# Altium project Mirror TurnSignal.PrjPcb
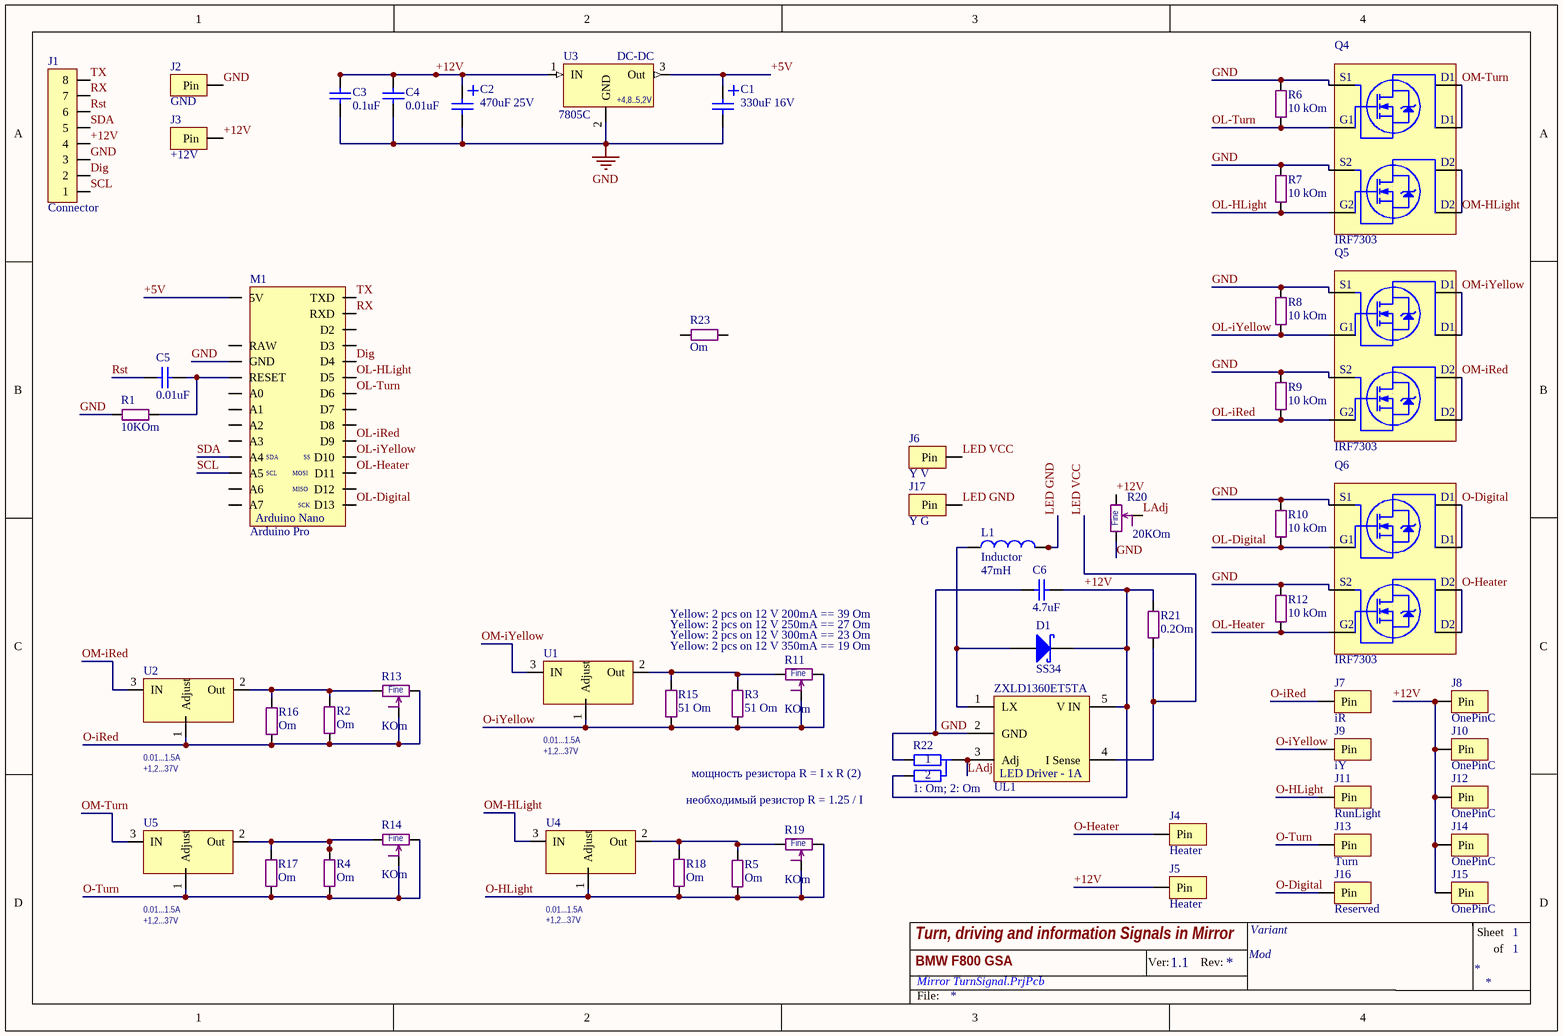
[diagram p0: Mirror TurnSignal.SchDoc]
1 sheet, 58 parts. Net scope: global (net labels, ports and power ports of the same name join across sheets).
Board files: Mirror TurnSignal (Right ver).PcbDoc, Mirror TurnSignal.PcbDoc

## Sheet Mirror TurnSignal.SchDoc: Turn, driving and information Signals in Mirror
size A4; SheetNumber: 1; SheetTotal: 1; Version: 1.1; Variant: Variant; Modification: Mod; Project: BMW F800 GSA

### Parts
C1  330uF 16V  [Cap E p3.5mm D8xH12 R - PR]
C2  470uF 25V  [Cap E p3.5mm D8xH12]
C3  0.1uF  [SMD 0805 (2012)]
C4  0.01uF  [SMD 0805 (2012)]
C5  0.01uF  [SMD 0805 (2012)]
C6  4.7uF  [SMD 1206 (3216)]
D1  SS34  [DO-214AC (SMA)]
J1  Connector  [Molex Micro-Fit 3.0 - 8 pin D R]
J2  GND  [OnePin 1.2x3]
J3  +12V  [OnePin 1.2x3]
J4  Heater  [OnePin 3x10mm Hole 0.7x8]
J5  Heater  [OnePin 3x10mm Hole 0.7x8]
J6  Y V  [OnePin 1.2x3]
J7  iR  [OnePin 1.2x3]
J8  OnePinC  [OnePin 1.2x3]
J9  iY  [OnePin 1.2x3]
J10  OnePinC  [OnePin 1.2x3]
J11  RunLight  [OnePin 1.2x3]
J12  OnePinC  [OnePin 1.2x3]
J13  Turn  [OnePin 1.2x3]
J14  OnePinC  [OnePin 1.2x3]
J15  OnePinC  [OnePin 1.2x3]
J16  Reserved  [OnePin 1.2x3]
J17  Y G  [OnePin 1.2x3]
L1  Inductor  value 47mH  [47 mkH]
M1  Arduino Pro  [Arduino Pro Mini Low (no A0-3,6-7,D3)]
Q4  IRF7303  [SO8]
Q5  IRF7303  [SO8]
Q6  IRF7303  [SO8]
R1  10KOm  [SMD 0805 (2012)]
R2  Om  [Res 2W p15.24]
R3  51 Om  [Res 2W p15.24]
R4  Om  [Res 2W p15.24]
R5  Om  [Res 2W p15.24]
R6  10 kOm  [SMD 0805 (2012)]
R7  10 kOm  [SMD 0805 (2012)]
R8  10 kOm  [SMD 0805 (2012)]
R9  10 kOm  [SMD 0805 (2012)]
R10  10 kOm  [SMD 0805 (2012)]
R11  КOm  [Res Adj 3296 Univ]
R12  10 kOm  [SMD 0805 (2012)]
R13  КOm  [Res Adj 3296 Univ]
R14  КOm  [Res Adj 3296 Univ]
R15  51 Om  [Res 2W p15.24]
R16  Om  [Res 2W p15.24]
R17  Om  [Res 2W p15.24]
R18  Om  [Res 2W p15.24]
R19  КOm  [Res Adj 3296 Univ]
R20  20КOm  [Res Adj 2.54 X 3]
R21  0.2Om  [SMD 2512 (6432)]
R22  1: Om; 2: Om  [SMD 0805 (2012) Double]
R23  Om  [Res 5W L22mm, p22.86]
U1  I output (A) Adjustable: 0.01...1.5A  V Out: +1,2...37V  [TO220 L - 20DG]
U2  I output (A) Adjustable: 0.01...1.5A  V Out: +1,2...37V  [TO220 L - 20DG]
U3  7805C  V Out: +4,8..5,2V  [D-PAK]
U4  I output (A) Adjustable: 0.01...1.5A  V Out: +1,2...37V  [TO220 L - 20DG]
U5  I output (A) Adjustable: 0.01...1.5A  V Out: +1,2...37V  [TO220 L - 20DG]
UL1  ZXLD1360ET5TA  [SOT-23-5]

### Nets
GND: C1.2 C2.2 C3.2 C4.2 C6.1 J1.3 J2.1(Pin) M1.GND Q4.1(S) Q4.3(S) Q5.1(S) Q5.3(S) Q6.1(S) Q6.3(S) R1.1 R6.2 R7.2 R8.2 R9.2 R10.2 R12.2 R20.1 R22.1 U3.2(GND) UL1.2(GND)
+5V: C1.1 M1.5V U3.3(Out)
+12V: C2.1 C3.1 C4.1 C6.2 D1.K J1.4 J3.1(Pin) J5.1(Pin) J8.1(Pin) J10.1(Pin) J12.1(Pin) J14.1(Pin) J15.1(Pin) R20.3 R21.2 R22.2 U3.1(IN) UL1.5(V_IN)
Dig: J1.2 M1.D4
LAdj: R20.2 R22.3 UL1.3(Adj)
LED GND: J17.1(Pin) L1.2
LED VCC: J6.1(Pin) R21.1 UL1.4(I_Sense)
O-Digital: J16.1(Pin) Q6.7(D) Q6.8(D)
O-Heater: J4.1(Pin) Q6.5(D) Q6.6(D)
O-HLight: J11.1(Pin) R5.1 R18.1 R19.2 R19.3 U4.1(Adjust)
O-iRed: J7.1(Pin) R2.1 R13.2 R13.3 R16.1 U2.1(Adjust)
O-iYellow: J9.1(Pin) R3.1 R11.2 R11.3 R15.1 U1.1(Adjust)
O-Turn: J13.1(Pin) R4.1 R14.2 R14.3 R17.1 U5.1(Adjust)
OL-Digital: M1.D13 Q6.2(G) R10.1
OL-Heater: M1.D11 Q6.4(G) R12.1
OL-HLight: M1.D5 Q4.4(G) R7.1
OL-iRed: M1.D9 Q5.4(G) R9.1
OL-iYellow: M1.D10 Q5.2(G) R8.1
OL-Turn: M1.D6 Q4.2(G) R6.1
OM-HLight: Q4.5(D) Q4.6(D) U4.3(IN)
OM-iRed: Q5.5(D) Q5.6(D) U2.3(IN)
OM-iYellow: Q5.7(D) Q5.8(D) U1.3(IN)
OM-Turn: Q4.7(D) Q4.8(D) U5.3(IN)
Rst: C5.1 J1.6
RX: J1.7 M1.RXD
SCL: J1.1 M1.A5
SDA: J1.5 M1.A4
TX: J1.8 M1.TXD
NetC5_2: C5.2 M1.RESET R1.2
NetD1_A: D1.A L1.1 UL1.1(LX)
NetR2_2: R2.2 R13.1 R16.2 U2.2(Out)
NetR3_2: R3.2 R11.1 R15.2 U1.2(Out)
NetR4_2: R4.2 R14.1 R17.2 U5.2(Out)
NetR5_2: R5.2 R18.2 R19.1 U4.2(Out)

Not connected (* = marked no-connect by the designer): M1 A0 A1 A2 A3 A6 A7 D2 D3 D7 D8 D12 RAW; R23 1 2

### Notes on the sheet
- (near U3) DC-DC
- (near R11) Yellow: 2 pcs on 12 V 350mA == 19 Om
- Yellow: 2 pcs on 12 V 300mA == 23 Om
- Yellow: 2 pcs on 12 V 200mA == 39 Om
- Yellow: 2 pcs on 12 V 250mA == 27 Om
- (near R22) мощность резистора R = I x R (2)
- необходимый резистор R = 1.25 / I
- Ver:
- Rev:
- Sheet
- of
- File:
- (in symbol Arduino Pro Micro) SDA; SS; SCL; MOSI; MISO; SCK; Arduino Nano
- (in symbol IRF7303) S1; D1; G1; S2; D2; G2
- (in symbol Res Adj 3296) Fine
- (in symbol ZXLD1360ET5TA) LED Driver - 1A

### Library data of the parts
C1 C2 = Cap Elecrolitic: Capacitor
C3-C6 = Cap SMD 0402-1812: Capacitor
D1 = D Shotki All: Shotki  Diode; VALUE: 1N5822; PackageReference: DO-201
J1 = Micro-Fit 8R (2x4): Horisontal, Dbl line, Male - 3mm
J2-J17 = OnePin Connector: Only pad
L1 = Inductor: Code_IEC: 1005; Published: 8-Jun-2000; LatestRevisionDate: 29-May-2009; LatestRevisionNote: IPC-7351 Footprint Added.; PackageReference: 0402-A; Publisher: Altium Limited; PackageDescription: Chip Inductor; Code_JEITA: 0402
M1 = Arduino Pro Micro
Q4-Q6 = IRF7303: Dual N-Ch  30V - 0.05Ω - 4.9A; Manufacturer: Farchild; RDS: <0.05Om; I d - Drain current (continuous) at TC = 70°C: 3.9 A; C In: 520pF; C Out: 180pF; V DSS (v): 30 v; I d - Drain current (continuous) at TC = 25°C: 4.9 A; Name: IRF7303; Datasheet: http://tec.org.ru/board/0-0-0-3164-20
R1-R10 R12 R15-R18 R21 = Res All Types
R11 R13 R14 R19 R20 = Res Adj 3296
R22 = Res SMD (Select one way): Choice from two resistors
R23 = Res 5W: 5W Cement
U1 U2 U4 U5 = LM-317: Voltage Regulator; Напряжение выход-вход (dropout): 2 v; Case: TO-220; Datasheet: http://www.ti.com/lit/ds/symlink/lm317.pdf
U3 = 7805C: Voltage Regulator; Manufacturer: Интеграл; I output (A): 1; Max Voltage In (V): 35; Напряжение выход-вход (dropout): >2V; t: -10..+70°C; Case: D2PAK; Shema: http://tec.org.ru/_bd/5/57349922.jpg; Name: 7805C
UL1 = ZXLD1360ET5TA: Led Driver - 1A, 7-30V In; PackageDescription: SOT-23-5; ComponentLink1URL: www.zetex.com; DataSheet URL: https://lib.chipdip.ru/296/DOC000296166.pdf; Name: ZXLD1360ET5TA